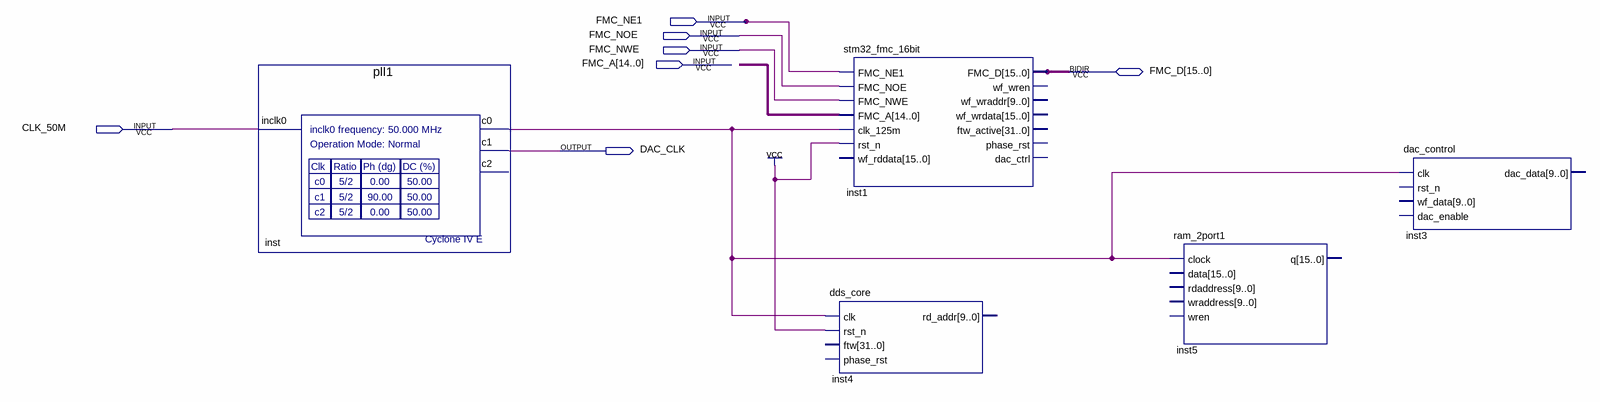
[diagram p0: schematic sheet]
// Quartus schematic FMC_Demo.bdf as structural Verilog: 5 symbols, 7 pins
module FMC_Demo (
  input  FMC_NE1,
  input  FMC_NOE,
  input  FMC_NWE,
  input  [14:0] FMC_A,
  input  CLK_50M,
  inout  [15:0] FMC_D,
  output DAC_CLK
);

  wire inst_c0;
  wire [14:0] undriven;

  pll1 inst (.inclk0(CLK_50M), .c0(inst_c0), .c1(DAC_CLK));  // open: c2
  stm32_fmc_16bit inst1 (
    .FMC_NE1(FMC_NE1), .FMC_NOE(FMC_NOE), .FMC_NWE(FMC_NWE), .FMC_A(undriven), .clk_125m(inst_c0),
    .rst_n(1'b1), .FMC_D(FMC_D));  // open: wf_rddata, wf_wren, wf_wraddr, wf_wrdata, ftw_active, phase_rst, dac_ctrl
  dds_core inst4 (.clk(inst_c0), .rst_n(1'b1));  // open: ftw, phase_rst, rd_addr
  ram_2port1 inst5 (.clock(inst_c0));  // open: data, rdaddress, wraddress, wren, q
  dac_control inst3 (.clk(inst_c0));  // open: rst_n, wf_data, dac_enable, dac_data
endmodule
